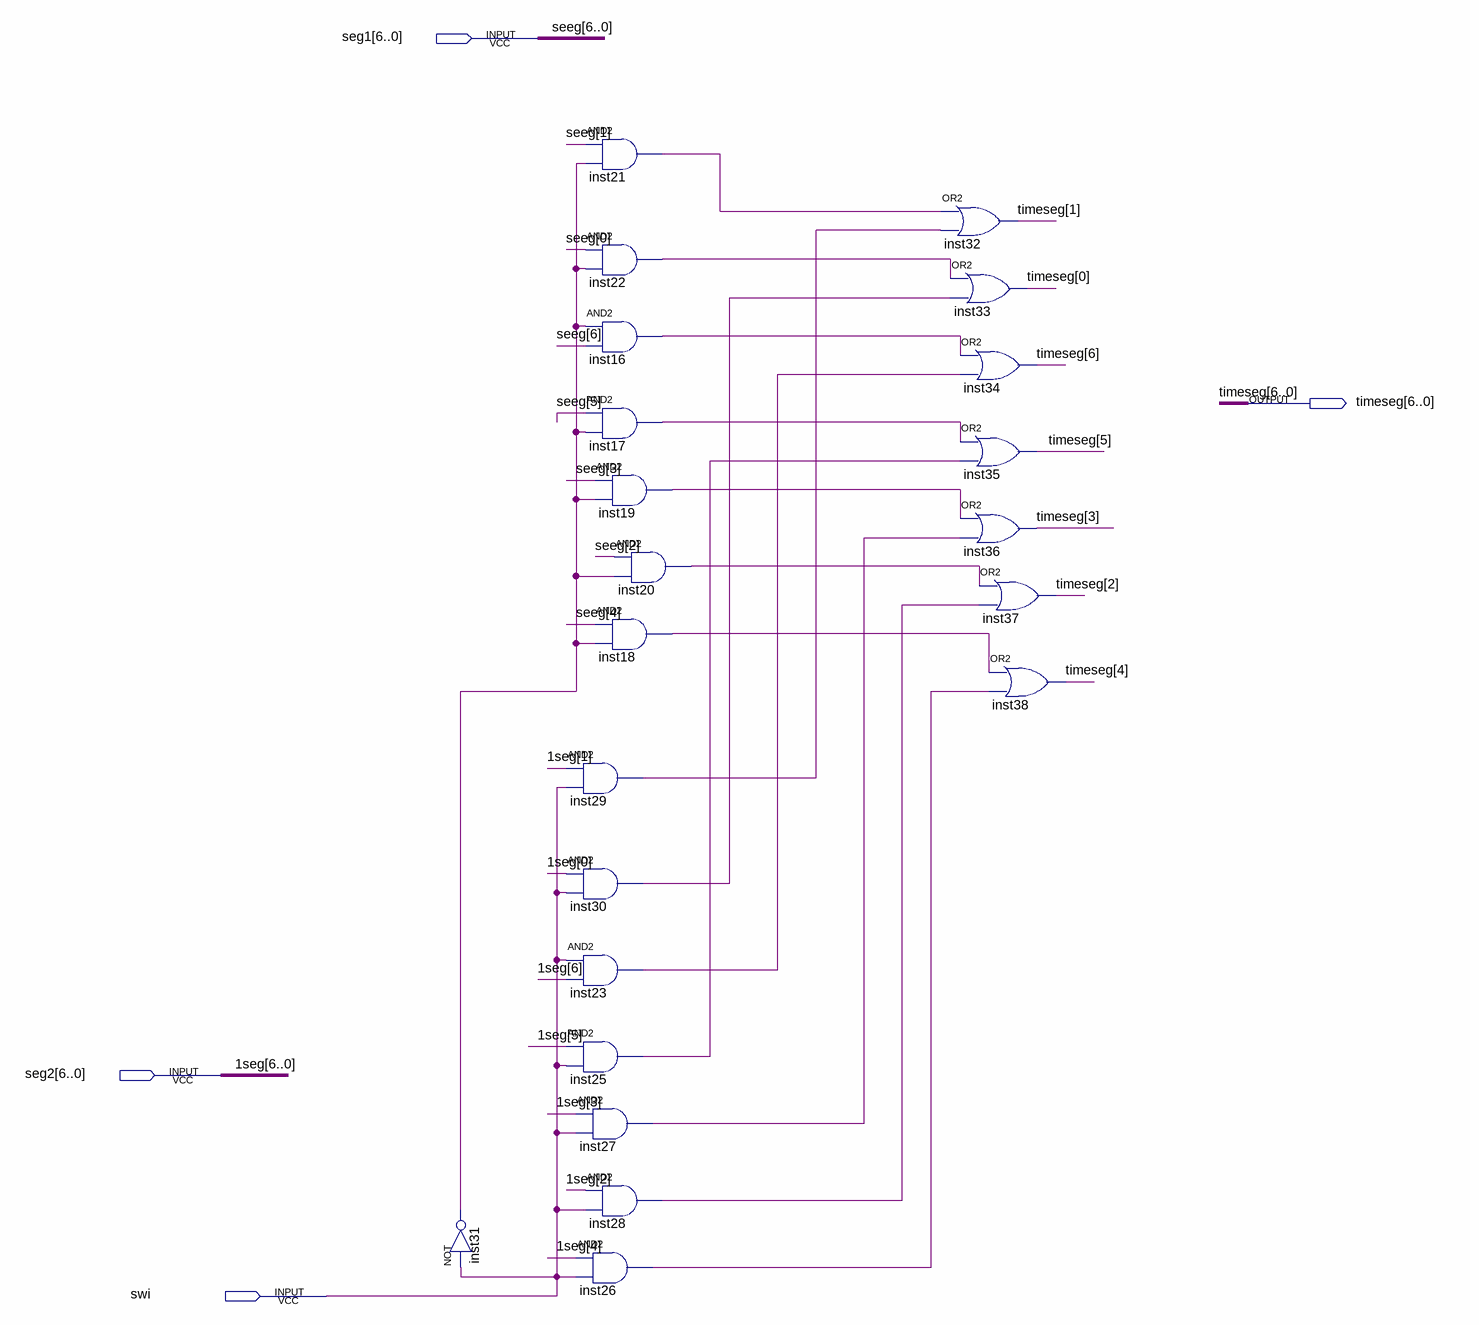
[diagram p0: schematic sheet]
// Quartus schematic chooseseg.bdf as structural Verilog: 22 symbols, 4 pins
module chooseseg (
  input  [6:0] seg1,
  input  [6:0] seg2,
  input  swi,
  output [6:0] timeseg
);

  wire inst16_out, inst17_out, inst18_out, inst19_out, inst20_out, inst21_out, inst22_out, inst23_out,
       inst25_out, inst26_out, inst27_out, inst28_out, inst29_out, inst30_out, inst31_out;

  not inst31 (inst31_out, swi);
  and inst21 (inst21_out, seg1[1], inst31_out);
  and inst22 (inst22_out, seg1[0], inst31_out);
  and inst16 (inst16_out, inst31_out, seg1[6]);
  and inst17 (inst17_out, seg1[5], inst31_out);
  and inst19 (inst19_out, seg1[3], inst31_out);
  and inst20 (inst20_out, seg1[2], inst31_out);
  and inst18 (inst18_out, seg1[4], inst31_out);
  and inst29 (inst29_out, seg2[1], swi);
  and inst30 (inst30_out, seg2[0], swi);
  and inst23 (inst23_out, swi, seg2[6]);
  and inst25 (inst25_out, seg2[5], swi);
  and inst27 (inst27_out, seg2[3], swi);
  and inst28 (inst28_out, seg2[2], swi);
  and inst26 (inst26_out, seg2[4], swi);
  or inst32 (timeseg[1], inst21_out, inst29_out);
  or inst33 (timeseg[0], inst22_out, inst30_out);
  or inst34 (timeseg[6], inst16_out, inst23_out);
  or inst35 (timeseg[5], inst17_out, inst25_out);
  or inst36 (timeseg[3], inst19_out, inst27_out);
  or inst37 (timeseg[2], inst20_out, inst28_out);
  or inst38 (timeseg[4], inst18_out, inst26_out);

  // Other names for the same wires on the sheet: 1seg[6:0] = seg2; seeg[6:0] = seg1
endmodule
